# Altium schematic sheet XtalFilter.SchDoc: Ararinha 6F
size A4; Revision: 1.0; SheetNumber: 5; SheetTotal: 7
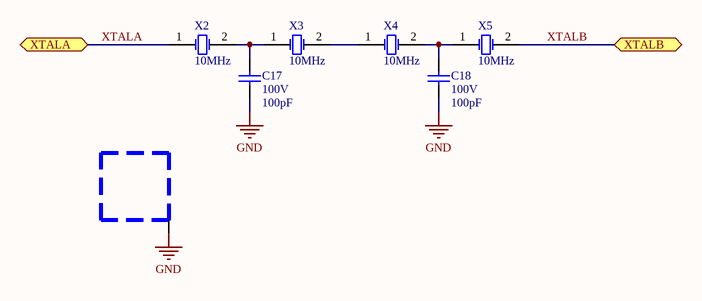
[diagram p0: XtalFilter.SchDoc]

## Parts
BL2  Blindagem BPF  [SHIELD_26.5X26.5]  (value not drawn)
C17  value 100pF  Tensão: 100V  [CC0603]  (hidden comment: Capacitor Cerâmico)
C18  value 100pF  Tensão: 100V  [CC0603]  (hidden comment: Capacitor Cerâmico)
X2  10MHz  [HC/49US]
X3  10MHz  [HC/49US]
X4  10MHz  [HC/49US]
X5  10MHz  [HC/49US]

## Ports
XTALA, XTALB (bidir)

## Nets
GND: BL2.1(GND) C17.1 C18.1
XTALA: X2.1(OSC1) ; port XTALA
XTALB: X5.2(OSC2) ; port XTALB
NetC17_2: C17.2 X2.2(OSC2) X3.1(OSC1)
NetC18_2: C18.2 X4.2(OSC2) X5.1(OSC1)
NetX3_2: X3.2(OSC2) X4.1(OSC1)

## Notes on the sheet
- Projeto:
- Tamanho:
- Data:
- A4
- Eng. Felipe Navarro
- Hora:
- Revisão:
- Folha
- de
- Arquivo:

## Library data of the parts
BL2 = Blindagem BPF: ChinesePrice: 0,00000; Chinês: ----; Corrente: *; Potência: *; Supplier 1: Digi-Key; Supplier Part Number 1: --Del; Tensão: *; Value: *; Obs:: *; Tolerância: *; ComponentLink1Description: Datasheet; ComponentLink1URL: D:\Tecnoclade\Datasheet\
C17 C18 = Cap 100pF 100V 0603 NP0: Capacitor (Semiconductor SIM Model); Chinês: -----; ChinesePrice: 0,00000; Corrente: *A; Potência: *W; Obs:: NP0; Tolerância: ±5%; Supplier 1: Digi-Key; Supplier Part Number 1: 1276-1295-1-ND; ComponentLink1Description: Datasheet; ComponentLink1URL: D:\Tecnoclade\Datasheet\!DataMissing.pdf
X2-X5 = XTAL: Crystal Oscillator; ChinesePrice: 0,00000; Chinês: ----; Value: 20pF/40R; Corrente: *; Potência: *; Supplier 1: Digi-Key; Supplier Part Number 1: ECS-100-18-5PX-TR; Tensão: *; Obs:: *; Tolerância: *